# EAGLE design unonano (EAGLE 7.2.0)
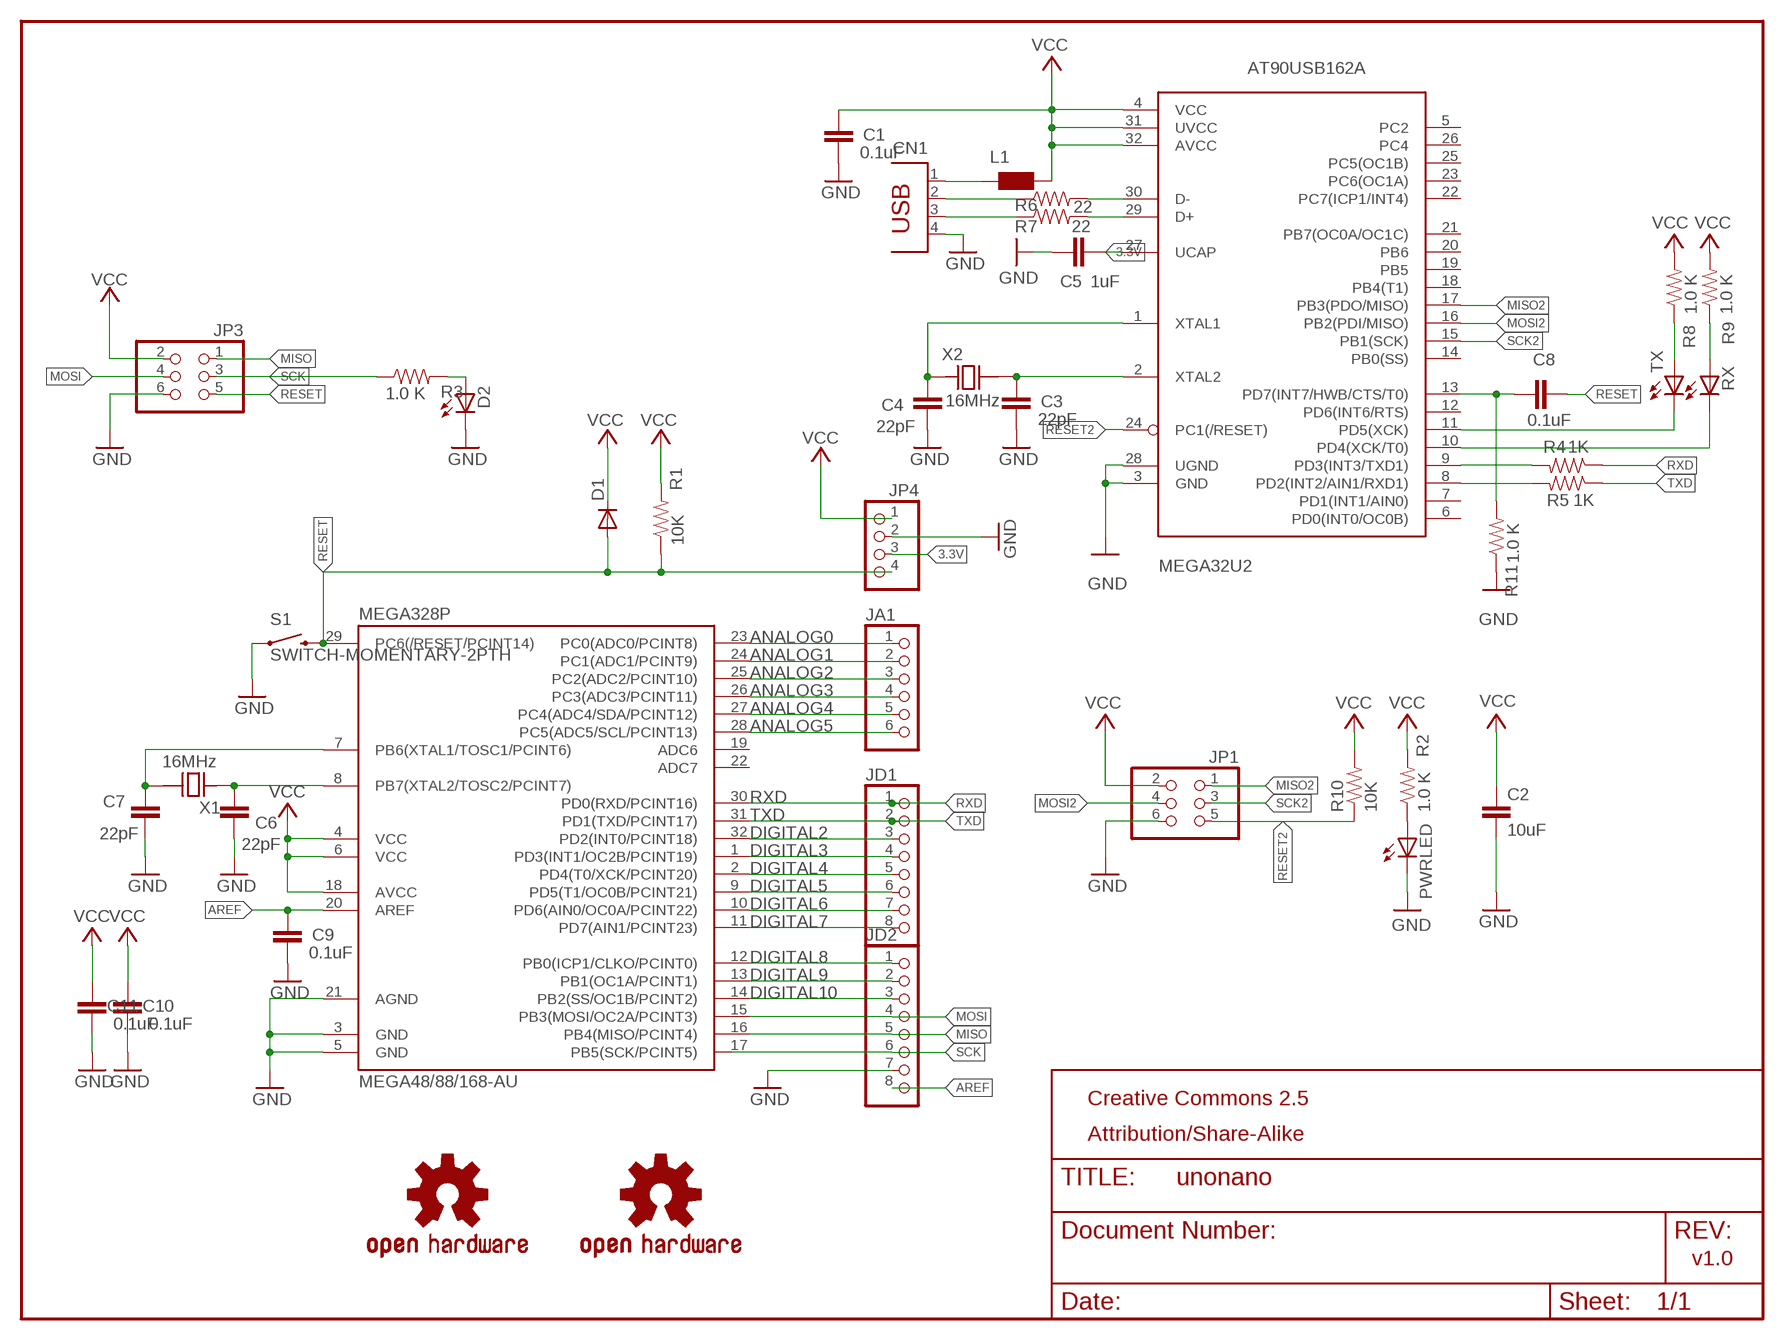
[diagram p0: schematic, sheet 1]

## Parts
C1  0.1uF  CAP0805  [0805]
C2  10uF  1.0UF50V10%(1206)  [1206]
C3  22pF  CAP0805  [0805]
C4  22pF  CAP0805  [0805]
C5  1uF  CAP0805  [0805]
C6  22pF  CAP0805  [0805]
C7  22pF  CAP0805  [0805]
C8  0.1uF  CAP0805  [0805]
C9  0.1uF  CAP0805  [0805]
C10  0.1uF  CAP0805  [0805]
C11  0.1uF  CAP0805  [0805]
CN1  PN61729  [PN61729]
D1  DIODESOD  [SOD-323]
D2  Green  LEDCHIP-LED0805  [CHIP-LED0805]
JA1  PINHD-1X6CB  [1X06-CLEANBIG]
JD1  PINHD-1X8CLEANBIG  [1X08-CLEANBIG]
JD2  PINHD-1X8CLEANBIG  [1X08-CLEANBIG]
JP1  PINHD-2X3  [2X03]
JP3  PINHD-2X3  [2X03]
JP4  PINHD-1X4CB  [1X04-CB]
L1  WE-CBF  [1812]
LOGO1  OSHW-LOGOL  [OSHW-LOGO-L]
LOGO2  OSHW-LOGOS  [OSHW-LOGO-S]
MEGA32U2  AT90USB162A  [TQFP32-08]
MEGA328P  MEGA48/88/168-AU  [TQFP32-08]
PWRLED  LEDCHIP-LED0805  [CHIP-LED0805]
R1  10K  RESISTOR0805-RES  [0805]
R2  1.0 K  RESISTOR0805-RES  [0805]
R3  1.0 K  RESISTOR0805-RES  [0805]
R4  1K  RESISTOR0805-RES  [0805]
R5  1K  RESISTOR0805-RES  [0805]
R6  22  RESISTOR0805-RES  [0805]
R7  22  RESISTOR0805-RES  [0805]
R8  1.0 K  RESISTOR0805-RES  [0805]
R9  1.0 K  RESISTOR0805-RES  [0805]
R10  10K  RESISTOR0805-RES  [0805]
R11  1.0 K  RESISTOR0805-RES  [0805]
RX  Green  LEDCHIP-LED0805  [CHIP-LED0805]
S1  SWITCH-MOMENTARY-2PTH  [TACTILE-PTH]
TX  Green  LEDCHIP-LED0805  [CHIP-LED0805]
X1  16MHz  CRYSTALFA238  [FA238]
X2  16MHz  CRYSTALFA238  [FA238]

## Nets
3.3V [PWR]: C5.1 JP4.3 MEGA32U2.27(UCAP)
ANALOG0: JA1.1 MEGA328P.23(PC0(ADC0/PCINT8))
ANALOG1: JA1.2 MEGA328P.24(PC1(ADC1/PCINT9))
ANALOG2: JA1.3 MEGA328P.25(PC2(ADC2/PCINT10))
ANALOG3: JA1.4 MEGA328P.26(PC3(ADC3/PCINT11))
ANALOG4: JA1.5 MEGA328P.27(PC4(ADC4/SDA/PCINT12))
ANALOG5: JA1.6 MEGA328P.28(PC5(ADC5/SCL/PCINT13))
AREF: C9.1 JD2.8 MEGA328P.20(AREF)
DIGITAL2: JD1.3 MEGA328P.32(PD2(INT0/PCINT18))
DIGITAL3: JD1.4 MEGA328P.1(PD3(INT1/OC2B/PCINT19))
DIGITAL4: JD1.5 MEGA328P.2(PD4(T0/XCK/PCINT20))
DIGITAL5: JD1.6 MEGA328P.9(PD5(T1/OC0B/PCINT21))
DIGITAL6: JD1.7 MEGA328P.10(PD6(AIN0/OC0A/PCINT22))
DIGITAL7: JD1.8 MEGA328P.11(PD7(AIN1/PCINT23))
DIGITAL8: JD2.1 MEGA328P.12(PB0(ICP1/CLKO/PCINT0))
DIGITAL9: JD2.2 MEGA328P.13(PB1(OC1A/PCINT1))
DIGITAL10: JD2.3 MEGA328P.14(PB2(SS/OC1B/PCINT2))
GND [PWR]: C1.2 C2.2 C3.2 C4.1 C5.2 C6.2 C7.1 C9.2 C10.2 C11.2 CN1.4 D2.C JD2.7 JP1.6 JP3.6 JP4.2 MEGA32U2.3(GND) MEGA32U2.28(UGND) MEGA328P.3(GND) MEGA328P.5(GND) MEGA328P.21(AGND) PWRLED.C R11.1 S1.1
MISO: JD2.5 JP3.1 MEGA328P.16(PB4(MISO/PCINT4))
MISO2: JP1.1 MEGA32U2.17(PB3(PDO/MISO))
MOSI: JD2.4 JP3.4 MEGA328P.15(PB3(MOSI/OC2A/PCINT3))
MOSI2: JP1.4 MEGA32U2.16(PB2(PDI/MISO))
N$1: C7.2 MEGA328P.7(PB6(XTAL1/TOSC1/PCINT6)) X1.3
N$2: C6.1 MEGA328P.8(PB7(XTAL2/TOSC2/PCINT7)) X1.1
N$3: PWRLED.A R2.1
N$4: D2.A R3.2
N$5: CN1.2 R6.1
N$6: CN1.3 R7.1
N$7: MEGA32U2.9(PD3(INT3/TXD1)) R4.2
N$8 [PWR]: CN1.1 L1.1
N$9: MEGA32U2.8(PD2(INT2/AIN1/RXD1)) R5.2
N$10: C8.1 MEGA32U2.13(PD7(INT7/HWB/CTS/T0)) R11.2
N$11: MEGA32U2.30(D-) R6.2
N$12: MEGA32U2.29(D+) R7.2
N$13: C3.1 MEGA32U2.2(XTAL2) X2.3
N$14: R8.1 TX.A
N$15: R9.1 RX.A
N$16: MEGA32U2.11(PD5(XCK)) TX.C
N$17: MEGA32U2.10(PD4(XCK/T0)) RX.C
N$18: C4.2 MEGA32U2.1(XTAL1) X2.1
RESET: C8.2 D1.2(A) JP3.5 JP4.4 MEGA328P.29(PC6(/RESET/PCINT14)) R1.1 S1.3
RESET2: JP1.5 MEGA32U2.24(PC1(/RESET)) R10.1
RXD: JD1.1 MEGA328P.30(PD0(RXD/PCINT16)) R4.1
SCK: JD2.6 JP3.3 MEGA328P.17(PB5(SCK/PCINT5)) R3.1
SCK2: JP1.3 MEGA32U2.15(PB1(SCK))
TXD: JD1.2 MEGA328P.31(PD1(TXD/PCINT17)) R5.1
VCC [PWR]: C1.1 C2.1 C10.1 C11.1 D1.1(C) JP1.2 JP3.2 JP4.1 L1.2 MEGA32U2.4(VCC) MEGA32U2.31(UVCC) MEGA32U2.32(AVCC) MEGA328P.4(VCC) MEGA328P.6(VCC) MEGA328P.18(AVCC) R1.2 R2.2 R8.2 R9.2 R10.2
Unconnected: MEGA32U2.5(PC2) MEGA32U2.6(PD0(INT0/OC0B)) MEGA32U2.7(PD1(INT1/AIN0)) MEGA32U2.12(PD6(INT6/RTS)) MEGA32U2.14(PB0(SS)) MEGA32U2.18(PB4(T1)) MEGA32U2.19(PB5) MEGA32U2.20(PB6) MEGA32U2.21(PB7(OC0A/OC1C)) MEGA32U2.22(PC7(ICP1/INT4)) MEGA32U2.23(PC6(OC1A)) MEGA32U2.25(PC5(OC1B)) MEGA32U2.26(PC4) MEGA328P.19(ADC6) MEGA328P.22(ADC7)

## Notes on the sheet
- Creative Commons 2.5
- Attribution/Share-Alike
- v1.0

## Library data of the parts
C1 C3-C11 = SparkFun-Capacitors:CAP: Capacitor Standard 0603 ceramic capacitor, and 0.1" leaded capacitor.
C2 = SparkFun-Capacitors:1.0UF50V10%(1206): CAP-09822; PROD_ID: CAP-09822; VALUE: 1.0uF
CN1 = con-berg:PN61729: BERG USB connector
D1 = SparkFun-DiscreteSemi:DIODE: Diode These are standard reverse protection diodes and small signal diodes. SMA package can handle up to about 1A. SOD-323 can handle about 200mA. What the SOD-323 package when ordering, there are some mfgs out there that are 5-pin packages.
D2 PWRLED RX TX = adafruit:LED: LED OSRAM: - CHIPLED LG R971, LG N971, LY N971, LG Q971, LY Q971, LO R971, LY R971 LH N974, LH R974 LS Q976, LO Q976, LY Q976 LO Q996 - Hyper CHIPLED LW Q18S LB Q993, LB Q99A, LB R99A - SideLED LS A670, LO A670, LY A670, LG A670, LP A670 LB A673, LV A673, LT A673, LW A673 LH A674 LY A675 LS A676, LA A676, LO A676, LY A676, LW A676 LS A679, LY A679, LG A679 - Hyper Micro SIDELED® LS Y876, LA Y876, LO Y876, LY Y876 LT Y87S - SmartLED LW L88C, LW L88S LB L89C, LB L89S, LG L890 LS L89K, LO L89K, LY L89K LS L896, LA L896, LO L896, LY L896 - TOPLED LS T670, LO T670, LY T670, LG T670, LP T670 LSG T670, LSP T670, LSY T670, LOP T670, LYG T670 LG T671, LOG T671, LSG T671 LB T673, LV T673, LT T673, LW T673 LH T674 LS T676, LA T676, LO T676, LY T676, LB T676, LH T676, LSB T676, LW T676 LB T67C, LV T67C, LT T67C, LS T67K, LO T67K, LY T67K, LW E67C LS E67B, LA E67B, LO E67B, LY E67B, LB E67C, LV E67C, LT E67C LW T67C LS T679, LY T679, LG T679 LS T770, LO T770, LY T770, LG T770, LP T770 LB T773, LV T773, LT T773, LW T773 LH T774 LS E675, LA E675, LY E675, LS T675 LS T776, LA T776, LO T776, LY T776, LB T776 LHGB T686 LT T68C, LB T68C - Hyper Mini TOPLED® LB M676 - Mini TOPLED Santana® LG M470 LS M47K, LO M47K, LY M47K Source: http://www.osram.convergy.de/
JA1 = carduino:PINHD-1X6: PIN HEADER
JD1 JD2 = carduino:PINHD-1X8: PIN HEADER
JP1 JP3 = pinhead-ez:PINHD-2X3: PIN HEADER
JP4 = carduino:PINHD-1X4: PIN HEADER
L1 = carduino:WE-CBF: SMD EMI Suppression Ferrite Beads - excellent anti-EMI properties - low DCR - impedances till 3000 ohms - rated current up to 6 A
LOGO1 LOGO2 = SparkFun-Aesthetics:OSHW-LOGO: Open Source Hardware Logo This logo indicates the piece of hardware it is found on incorporates a OSHW license and/or adheres to the definition of open source hardware found here: http://freedomdefined.org/OSHW
MEGA32U2 = adafruit:AT90USB162: MICROCONTROLLER 8 Kbytes FLASH 1 kbytes SRAM 512 bytes EEPROM USART 6-channel 10 bit ADC 2-channel 8 bit ADC
MEGA328P = avr-4:MEGA48/88/168
R1-R11 = SparkFun-Resistors:RESISTOR: Resistor Basic schematic elements and footprints for 0603, 1206, and PTH resistors.
S1 = SparkFun-Electromechanical:SWITCH-MOMENTARY-2: Various NO switches- pushbuttons, reed, etc
X1 X2 = SRT162-010:CRYSTAL

## Net classes
0 default: width 0.203 mm
1 PWR: width 0.381 mm

## Board
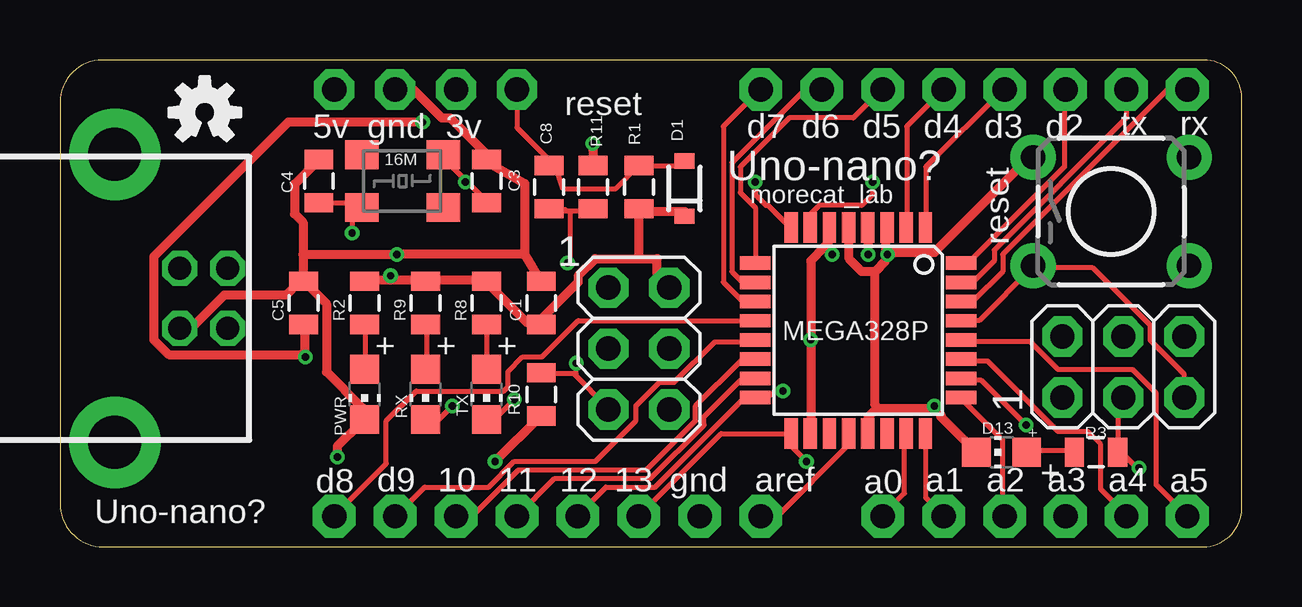
[diagram p1: board, top side]
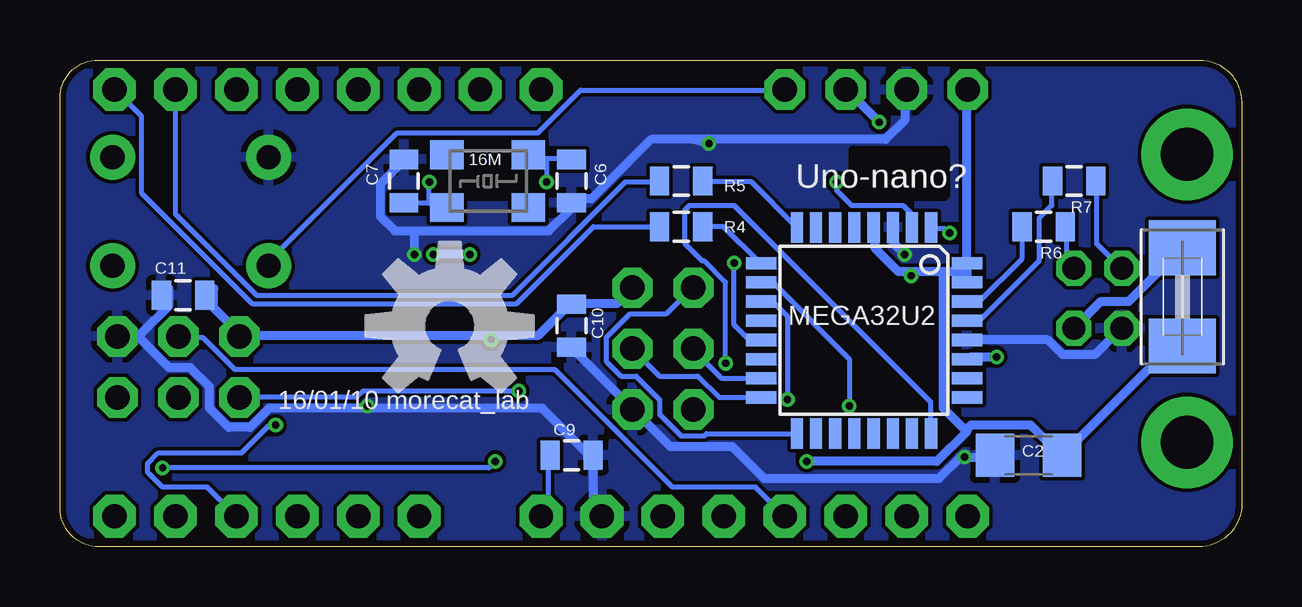
[diagram p2: board, bottom side, seen from below]

Size 49.26 x 20.28 mm. Coordinates in mm from the lower left corner, seen from the top.
Outline: 0,18.52 0,1.8 arc90 1.8,0 47.64,0 arc90 49.26,1.62 49.26,18.7 arc90 47.67,20.28 1.77,20.28 arc90 0,18.52
Copper layers (1*16): Top 0.035mm / dielectric 1.5mm / Bottom 0.035mm
Design rules "SeeedStudio_2layer_DRU_no_angle_20140221a": minimum track width 6mil, minimum drill 12mil, track to track 6mil, track to pad 6mil, pad to pad 6mil, via to via 6mil, smd to smd 0mil, copper to edge 10mil, drill to drill 10mil, minimum pad ring 10mil, minimum via ring 6mil, stop-mask expansion 2mil, vias tented up to drill 25mil, thermal gap 10mil
tRestrict: area 10.2,23.5 to 13.3,25.4; area 13,14.6 to 15.6,16.5; area 29.5,14.6 to 33.3,16.5
bRestrict: area 10.2,26 to 13.3,27.9; area 26.7,24.1 to 34.3,26.7; area 12.4,14.6 to 16.2,16.5; area 30.2,14.6 to 32.7,16.5

### Footprints (pad centres in the part's own frame; a part is rotated, then mirrored left to right if it is on the bottom)
0805 = smd 0.8 x 1.2: 1 -0.9,0; 2 0.9,0
1206 = smd 1.6 x 1.8: 1 -1.4,0; 2 1.4,0
PN61729 = drill 0.95 octagon: 1 1.25,4.71; 2 -1.25,4.71; 3 -1.25,2.71; 4 1.25,2.71 | drill 2.2 pad 3.81: P$1 -6,0; P$2 6,0
SOD-323 = smd 0.63 x 0.83: 1 -1.15,0; 2 1.15,0
CHIP-LED0805 = smd 1.2 x 1.2: A 0,-1.05; C 0,1.05
1X06-CLEANBIG = drill 1.016 pad 1.778 octagon: 1 -6.35,0; 2 -3.81,0; 3 -1.27,0; 4 1.27,0; 5 3.81,0; 6 6.35,0
1X08-CLEANBIG = drill 1.016 pad 1.778 octagon: 1 -8.89,0; 2 -6.35,0; 3 -3.81,0; 4 -1.27,0; 5 1.27,0; 6 3.81,0; 7 6.35,0; 8 8.89,0
2X03 = drill 1.016 pad 1.676 octagon: 1 -2.54,-1.27; 2 -2.54,1.27; 3 0,-1.27; 4 0,1.27; 5 2.54,-1.27; 6 2.54,1.27
1X04-CB = drill 1.016 pad 1.676 octagon: 1 -3.81,0; 2 -1.27,0; 3 1.27,0; 4 3.81,0
1812 = smd 2.286 x 2.794: 1 -2.046,0; 2 2.046,0
TQFP32-08 = smd 1.27 x 0.508: 1 -4.293,2.8; 2 -4.293,2; 3 -4.293,1.2; 4 -4.293,0.4; 5 -4.293,-0.4; 6 -4.293,-1.2; 7 -4.293,-2; 8 -4.293,-2.8; 17 4.293,-2.8; 18 4.293,-2; 19 4.293,-1.2; 20 4.293,-0.4; 21 4.293,0.4; 22 4.293,1.2; 23 4.293,2; 24 4.293,2.8 | smd 0.508 x 1.27: 9 -2.8,-4.293; 10 -2,-4.293; 11 -1.2,-4.293; 12 -0.4,-4.293; 13 0.4,-4.293; 14 1.2,-4.293; 15 2,-4.293; 16 2.8,-4.293; 25 2.8,4.293; 26 2,4.293; 27 1.2,4.293; 28 0.4,4.293; 29 -0.4,4.293; 30 -1.2,4.293; 31 -2,4.293; 32 -2.8,4.293
TQFP32-08' = smd 1.27 x 0.559: 1 -4.293,2.8; 2 -4.293,2; 3 -4.293,1.2; 4 -4.293,0.4; 5 -4.293,-0.4; 6 -4.293,-1.2; 7 -4.293,-2; 8 -4.293,-2.8; 17 4.293,-2.8; 18 4.293,-2; 19 4.293,-1.2; 20 4.293,-0.4; 21 4.293,0.4; 22 4.293,1.2; 23 4.293,2; 24 4.293,2.8 | smd 0.559 x 1.27: 9 -2.8,-4.293; 10 -2,-4.293; 11 -1.2,-4.293; 12 -0.4,-4.293; 13 0.4,-4.293; 14 1.2,-4.293; 15 2,-4.293; 16 2.8,-4.293; 25 2.8,4.293; 26 2,4.293; 27 1.2,4.293; 28 0.4,4.293; 29 -0.4,4.293; 30 -1.2,4.293; 31 -2,4.293; 32 -2.8,4.293
TACTILE-PTH = drill 1.016 pad 1.88: 1 -3.251,2.261; 2 3.251,2.261; 3 -3.251,-2.261; 4 3.251,-2.261
FA238 = smd 1.4 x 1.2: 1 -1.7,-1.1; 2 1.7,-1.1; 3 1.7,1.1; 4 -1.7,1.1

### Placement (x,y rotation side)
C1  20.07,10.16 90 top
C2  8.89,3.81 180 bottom
C3  17.78,15.24 90 top
C4  10.79,15.24 270 top
C5  10.16,10.16 90 top
C6  27.94,15.24 270 bottom
C7  34.92,15.24 270 bottom
C8  20.38,14.99 90 top
C9  27.94,3.81 0 bottom
C10  27.94,9.21 270 bottom
C11  44.13,10.48 180 bottom
CN1  2.29,10.35 270 top
D1  26.03,14.92 90 top
D2  39.24,3.94 90 top
JA1  40.64,1.27 0 top
JD1  38.1,19.05 180 top
JD2  20.32,1.27 0 top
JP1  24.13,8.26 270 top
JP3  44.32,7.49 0 top
JP4  15.24,19.05 0 top
L1  2.48,10.41 270 bottom
LOGO1  33.02,9.21 0 bottom
LOGO2  6.03,18.1 0 top
MEGA32U2  15.75,9.02 270 bottom
MEGA328P  MEGA48/88/168-AU  [TQFP32-08']  33.27,9.02 270 top
PWRLED  12.7,6.35 180 top
R1  24.13,14.99 270 top
R2  12.7,10.16 90 top
R3  43.18,3.94 180 top
R4  23.37,13.34 0 bottom
R5  23.37,15.24 0 bottom
R6  8.25,13.34 180 bottom
R7  6.98,15.24 180 bottom
R8  17.78,10.16 90 top
R9  15.24,10.16 90 top
R10  20.07,6.35 270 top
R11  22.22,14.99 270 top
RX  15.24,6.35 180 top
S1  43.81,13.97 0 top
TX  17.78,6.35 180 top
X1  31.43,15.24 180 bottom
X2  14.29,15.24 0 top

### Tracks (layer width: path | path; a pad name or v marks a point on that pad's centre or on a via)
3.3V  (via drill 0.3)
  Top 0.381: C5.1 10.22,9.25 v10.22,7.91 10.05,8 4.53,8 3.91,8.62 3.91,12.09 9.51,17.69 v15.11,17.69
  Bottom 0.381: v10.22,7.91 11.29,7.91 11.38,7.82 MEGA32U2.27 | v15.11,17.69 16.45,19.02 JP4.3
ANALOG0
  Top 0.203: MEGA328P.23 35.2,4.71 35.2,2.22 34.31,1.33 JA1.1
ANALOG1
  Top 0.203: MEGA328P.24 36.09,4.71 36.09,2.04 36.8,1.33 JA1.2
ANALOG2
  Top 0.203: MEGA328P.25 37.6,6.13 39.29,4.45 39.29,1.33 JA1.3
ANALOG3  (via drill 0.3)
  Top 0.203: v40.27,5.07 38.4,6.93 37.6,6.93 MEGA328P.26
  Bottom 0.203: v40.27,5.07 40.54,5.07 41.69,3.91 45.16,3.91 45.61,3.47 45.61,3.11 44.98,2.49 43.12,2.49 41.96,1.33 JA1.4
ANALOG4
  Top 0.203: MEGA328P.27 37.6,7.73 38.67,7.73 41.6,4.8 42.85,4.8 43.38,4.27 43.38,2.4 44.45,1.33 JA1.5
ANALOG5
  Top 0.203: MEGA328P.28 37.6,8.53 40.45,8.53 41.6,7.38 44.72,7.38 45.69,6.4 45.69,2.58 46.94,1.33 JA1.6
AREF
  Top 0.203: MEGA328P.20 32.8,4.71 32.8,4.18 29.96,1.33 29.25,1.33 JD2.8
  Bottom 0.203: C9.1 28.89,3.73 28.89,1.6 29.16,1.33 JD2.8
DIGITAL2
  Top 0.203: MEGA328P.32 37.6,11.82 37.87,11.82 41.87,15.82 41.87,19.02 JD1.3
DIGITAL3
  Top 0.203: MEGA328P.1 36.09,13.34 36.09,15.82 39.29,19.02 JD1.4
DIGITAL4
  Top 0.203: JD1.5 35.29,17.51 35.29,13.34 MEGA328P.2
DIGITAL5
  Top 0.203: MEGA328P.9 28.98,14.13 28.36,14.76 28.36,15.82 30.4,17.87 33.07,17.87 34.23,19.02 JD1.6
DIGITAL6
  Top 0.203: MEGA328P.10 28.45,11.02 28,11.47 28,16 31.03,19.02 31.74,19.02 JD1.7
DIGITAL7
  Top 0.203: MEGA328P.11 28.45,10.22 27.65,11.02 27.65,17.51 29.16,19.02 JD1.8
DIGITAL8
  Top 0.203: MEGA328P.12 21.6,9.42 20.09,7.91 19.29,7.91 18.67,7.29 18.67,6.67 18.49,6.49 14.85,6.49 13.6,5.25 13.6,3.47 11.47,1.33 JD2.1
DIGITAL9
  Top 0.203: MEGA328P.13 28.98,8.53 27.29,8.53 25.6,6.84 24.98,6.84 24,5.87 24,5.25 22.31,3.56 18.94,3.56 17.87,2.49 15.2,2.49 14.05,1.33 JD2.2
DIGITAL10
  Top 0.203: MEGA328P.14 28.98,7.73 28.36,7.73 26.49,5.87 26.49,5.25 24.45,3.2 19.11,3.2 17.25,1.33 16.53,1.33 JD2.3
GND  (via drill 0.3)
  Top 0.381: 33.96,11.47 33.43,11.47 32.89,12 32.89,13.25 MEGA328P.5 | 33.96,11.47 34.4,11.91 34.4,12.18 | 34.4,12.27 34.4,13.25 MEGA328P.3 | 34.4,12.27 34.4,12.18 | 36.45,5.78 36.72,5.51 36.72,5.42 38.14,4 D2.C | 34.05,5.78 36.45,5.78 | 34.05,5.78 33.69,5.42 33.69,4.8 MEGA328P.21 | 33.96,11.47 33.96,5.96 34.05,5.78 | 34.4,12.27 36.45,12.27 40.36,16.18 40.54,16.18 S1.1 | v36.45,5.87 36.45,5.78 | 10.13,12.18 10.13,13.51 9.78,13.87 9.78,15.11 10.76,16.09 C4.1 | 10.13,12.18 10.13,11.11 C5.2 | C5.2 10.31,10.94 11.11,10.13 11.11,7.29 12.62,5.78 12.62,5.33 PWRLED.C 12.53,5.16 11.56,4.18 v11.56,3.73 | 10.13,12.18 v14.05,12.18 19.37,12.18 | CN1.4 5.07,9.16 5.51,9.16 6.84,10.49 9.42,10.49 9.96,11.02 C5.2 | JP4.2 14.05,19.02 14.76,19.02 15.91,17.87 16.27,17.87 17.78,16.36 C3.2 17.87,16 19.37,15.14 19.37,12.18 | 19.37,12.18 20,11.11 C1.2 | v34.49,12.18 34.4,12.18 | R11.1 22.22,16.51 v22.21,16.8
  Bottom 0.381: JD2.7 26.67,1.33 27.03,1.69 27.03,3.73 C9.2 27.2,3.82 29.16,5.78 36.45,5.78 | 45.96,8.71 46.85,8.71 JP3.6 | 45.96,8.71 44.72,7.47 43.83,7.47 43.03,6.67 43.03,5.78 42.23,4.98 41.34,4.98 40.54,5.78 36.45,5.78 | v36.45,5.87 36.45,5.78 | C10.2 27.91,8.27 25.42,5.78 JP1.6 25.25,5.6 23.82,4.18 21.25,4.18 19.91,2.85 12.62,2.85 11.73,3.73 v11.56,3.73 10.31,3.73 C2.2 | MEGA32U2.28 11.38,8.62 8.09,8.62 7.47,8 6.13,8 5.07,9.07 CN1.4 | v14.05,12.18 14.49,12.62 14.49,13.25 MEGA32U2.3 | 34.49,13.16 35.29,13.16 35.92,13.78 35.92,15.11 34.94,16.09 C7.1 | 34.49,13.16 28.89,13.16 28,14.05 28,14.31 C6.2 27.83,14.49 27.11,14.49 24.62,16.98 22.85,16.98 | 22.85,16.98 14.85,16.98 14.05,17.78 14.05,19.02 JP4.2 | 34.49,13.16 v34.49,12.18 | C11.2 44.72,10.76 44.72,10.05 45.87,8.89 45.96,8.71 | v22.21,16.8 22.85,16.98
  pour Bottom: 0,20.32 0,0 49.53,0 49.53,20.32
MISO  (via drill 0.3)
  Top 0.203: JD2.5 21.6,1.33 22.76,2.49 24.8,2.49 28.45,6.13 28.98,6.13 MEGA328P.16 29.07,6.22 29.51,6.22 29.78,6.49 v30.14,6.49
  Bottom 0.203: JP3.1 36.89,6.22 36.63,6.49 v30.14,6.49
MISO2
  Bottom 0.203: MEGA32U2.17 18.58,4.71 22.31,4.71 22.4,4.62 23.38,4.62 24.27,5.51 24.27,6.13 25.25,7.11 25.87,7.11 26.49,7.73 26.49,8.71 25.51,9.69 24,9.69 22.94,10.76 JP1.1
MOSI
  Top 0.203: JD2.4 20.62,2.85 24.62,2.85 26.85,5.07 26.85,5.42 28.36,6.93 28.98,6.93 MEGA328P.15
  Bottom 0.203: JD2.4 20.27,2.49 23.74,2.49 28.63,7.38 41.96,7.38 43.29,8.71 44.27,8.71 JP3.4
MOSI2
  Bottom 0.203: MEGA32U2.16 20.09,6.22 21.78,6.22 22.67,7.11 24.27,7.11 25.34,8.18 JP1.4
N$1  (via drill 0.3)
  Top 0.203: v33.87,15.2 33.87,14.67 33.43,14.22 31.65,14.22 31.29,13.87 31.29,13.34 MEGA328P.7
  Bottom 0.203: 33.87,14.31 33.25,14.31 33.16,14.22 X1.3 | 33.87,14.31 34.85,14.31 C7.2 | 33.87,14.31 v33.87,15.2
N$2  (via drill 0.3)
  Top 0.203: v28.98,15.2 28.98,14.67 29.43,14.22 29.51,14.22 30.4,13.34 MEGA328P.8
  Bottom 0.203: 28.98,16.18 29.6,16.18 29.69,16.27 X1.1 | 28.98,16.18 28,16.18 C6.1 | 28.98,16.18 v28.98,15.2
N$3
  Top 0.203: PWRLED.A 12.71,7.47 12.71,9.25 R2.1
N$4
  Top 0.203: D2.A 40.36,4 42.23,4 R3.2
N$5
  Bottom 0.203: R6.1 7.29,13.34 7.29,11.91 7.02,11.65 CN1.2
N$6
  Bottom 0.203: R7.1 6.04,15.2 6.04,12.62 5.07,11.65 CN1.3
N$7
  Bottom 0.203: R4.2 21.6,13.34 20.09,11.82 MEGA32U2.9
N$8
  Bottom 0.381: L1.1 2.49,12.45 4.71,10.22 5.87,10.22 6.93,9.16 CN1.1
N$9
  Bottom 0.203: R5.2 22.4,15.2 20.45,15.2 18.58,13.34 MEGA32U2.8
N$10  (via drill 0.3)
  Top 0.203: 21.07,11.91 v21.16,11.82 21.27,12.06 21.27,13.97 | 21.07,14.05 C8.1 20.95,13.97 21.27,13.97 | 22.21,14.05 R11.2 22.22,13.97 21.27,13.97
  Bottom 0.203: v21.16,11.82 21.16,9.25 20.54,8.62 20.09,8.62 MEGA32U2.13
N$11
  Bottom 0.203: R6.2 9.16,12 10.93,10.22 11.38,10.22 MEGA32U2.30
N$12
  Bottom 0.203: R7.2 7.91,15.2 7.91,14.22 8.44,13.69 8.44,11.91 10.93,9.42 11.38,9.42 MEGA32U2.29
N$13  (via drill 0.3)
  Top 0.203: 16.93,15.25 15.91,16.27 X2.3 | 16.93,15.25 17.78,14.4 C3.1 | v16.89,15.2 16.93,15.25
  Bottom 0.203: v16.89,15.2 16.89,14.85 16.27,14.22 14.13,14.22 13.78,13.87 13.78,13.34 MEGA32U2.2
N$14
  Top 0.203: R8.1 TX.A
N$15
  Top 0.203: RX.A 15.29,7.47 15.29,9.25 R9.1
N$16  (via drill 0.3)
  Top 0.203: v18.94,6.13 18.14,5.33 17.78,5.33 TX.C
  Bottom 0.203: v18.94,6.13 18.94,9.6 19.47,10.13 20,10.13 MEGA32U2.11
N$17  (via drill 0.3)
  Top 0.203: v16.36,5.87 15.82,5.33 15.29,5.33 RX.C
  Bottom 0.203: v16.36,5.87 16.36,7.82 19.47,10.94 20,10.94 MEGA32U2.10
N$18  (via drill 0.3)
  Top 0.203: C4.2 10.85,14.31 12.45,14.31 12.53,14.22 X2.1 12.18,14.22 v12.18,13.07
  Bottom 0.203: v12.18,13.07 12.36,13.25 12.89,13.25 MEGA32U2.1
RESET
  Top 0.203: 20.75,15.91 C8.2 | 20.43,16 C8.2 | 19.11,19.02 JP4.4 19.05,17.46 20.32,16.19 C8.2 | MEGA328P.29 37.6,9.42 38.32,9.42 40.54,11.65 S1.3 40.63,11.65 43.03,11.65 45.43,9.25 45.43,8.62 46.85,7.2 JP3.5 | 24.27,15.82 24.08,15.82 | 24.08,15.82 R1.1 24.13,15.88 | 24.13,15.88 26.03,15.88 D1.2 | 24.08,15.82 23.18,14.92 20.95,14.92 20.64,15.88 C8.2 | 24.08,15.82 24.13,15.88
  Bottom 0.203: JP4.4 19.11,19.02 27.56,19.02 29.34,17.25 35.2,17.25 40.54,11.91 40.54,11.73 S1.3
RESET2  (via drill 0.3)
  Top 0.203: 21.42,7.2 20.09,7.2 R10.1 | 21.42,7.2 22.85,5.78 JP1.5 | v21.51,7.64 21.51,7.2 21.42,7.2
  Bottom 0.203: v21.51,7.64 21.51,11.02 22.4,11.91 22.49,11.91 23.2,12.62 23.2,14.05 23.02,14.22 21.16,14.22 12.98,6.04 12.98,4.8 MEGA32U2.24
RXD
  Top 0.203: MEGA328P.30 37.6,10.22 38.05,10.22 39.29,11.47 39.29,12.18 46.14,19.02 46.94,19.02 JD1.1
  Bottom 0.203: R4.1 27.03,13.34 30.23,10.13 41.25,10.13 45.87,14.76 45.87,17.96 46.94,19.02 JD1.1
SCK  (via drill 0.3)
  Top 0.203: JP3.3 44.27,6.22 44.09,6.04 44.09,4 R3.1 44.18,4 44.89,3.29 v44.98,3.29 | JD2.6 24.18,1.33 27.56,4.71 30.4,4.71 MEGA328P.17 30.4,4.62 30.4,4.27 v31.11,3.56
  Bottom 0.203: v44.98,3.29 31.38,3.29 v31.11,3.56
SCK2
  Bottom 0.203: MEGA32U2.15 20.09,7.02 21.69,7.02 22.85,8.18 JP1.3
TXD
  Top 0.203: JD1.2 44.45,17.87 38.94,12.36 38.94,11.91 38.05,11.02 37.6,11.02 MEGA328P.31
  Bottom 0.203: JD1.2 44.45,13.87 41.07,10.49 30.4,10.49 25.69,15.2 24.27,15.2 R5.1
VCC  (via drill 0.3)
  Top 0.381: v18.14,3.56 20,5.42 R10.2 | 31.87,12.49 32,12.62 32,13.25 MEGA328P.6 | 31.87,12.49 31.29,11.91 v31.29,8.62 31.29,4.8 MEGA328P.18 | v33.69,12.18 33.69,13.25 MEGA328P.4 | 31.87,12.49 v32.18,12.18 | 13.78,11.11 15.2,11.11 R9.2 15.38,11.11 17.6,11.11 R8.2 17.78,11.02 19.47,9.34 20,9.34 C1.1 20.09,9.51 21.6,11.02 21.6,11.29 22.31,12 24.13,12 | 13.78,11.11 12.71,11.11 R2.2 | 25.34,10.85 JP1.2 25.25,11.02 24.89,11.38 24.89,12 24.13,12 | v13.78,11.29 13.78,11.11 | 24.26,14.19 24.11,13.91 | 24.11,13.91 R1.2 24.13,12 | D1.1 26.03,13.97 24.76,13.97 24.11,13.91
  Bottom 0.381: 11.47,11.47 11.47,11.73 MEGA32U2.32 11.47,12 11.47,19.02 JP4.1 | 11.47,11.47 MEGA32U2.31 | 11.47,11.47 12.45,11.47 | 12.45,11.47 13.78,11.47 | 13.78,11.47 14.31,11.47 15.29,12.45 15.29,13.25 MEGA32U2.4 | v18.14,3.56 12.71,3.56 11.47,4.8 11.47,4.89 | 11.47,4.89 11.29,5.07 8.8,5.07 7.56,3.82 C2.1 7.38,3.91 2.93,8.36 2.49,8.36 L1.2 | 12.45,11.47 12.45,5.78 11.65,4.98 11.47,4.89 | v32.18,12.18 v33.69,12.18 | JP1.2 25.42,10.76 26.05,10.13 27.91,10.13 C10.1 28.09,10.05 29.34,8.8 31.29,8.8 | 31.29,8.8 41.78,8.8 JP3.2 41.87,8.98 42.85,9.96 42.85,10.76 C11.1 | v31.29,8.62 31.29,8.8 | v13.78,11.29 13.78,11.47

### Text on the board
tPlace: reset | 5v | gnd | 3v | d7 | d6 | d5 | d4 | d3 | d2 | tx | rx | 16M | reset | Uno-nano? | morecat_lab | 1 | 1 | PWR | D13 | + | d8 | d9 | 10 | 11 | 12 | 13 | gnd | aref | a0 | a1 | a2 | a3 | a4 | a5 | Uno-nano?
bPlace: 16M | Uno-nano? | 16/01/10 morecat_lab